# Altium schematic sheet Micro.SchDoc
size A4
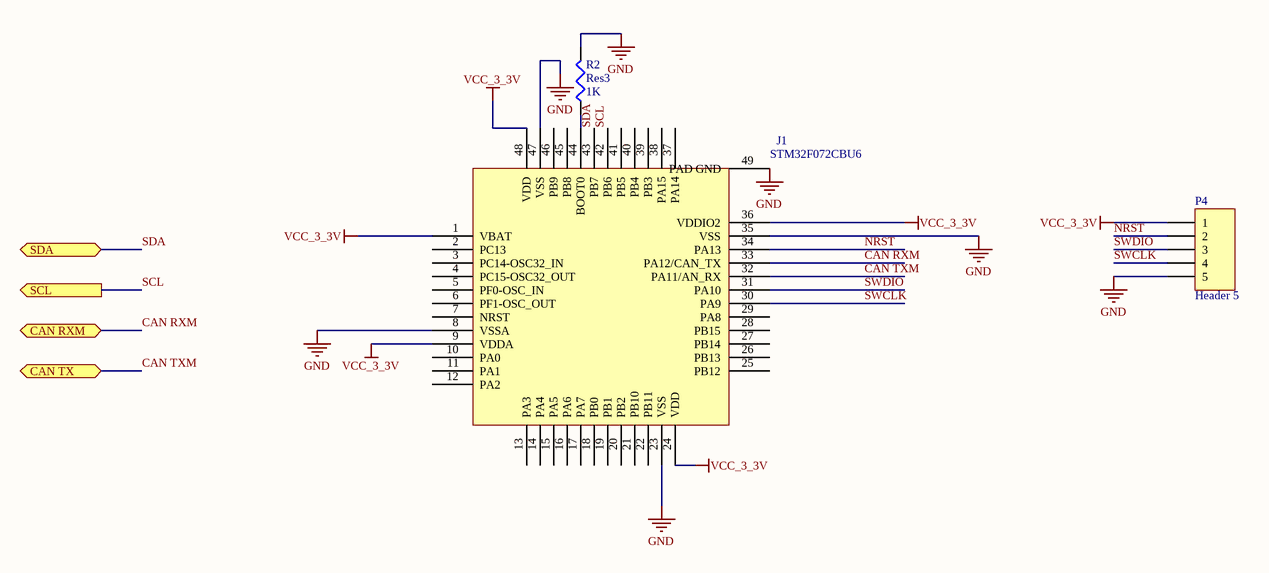
[diagram p0: Micro.SchDoc]

## Parts
J1  STM32F072CBU6  [STM32F072CBU6 - duplicate]
P4  Header 5  [HDR1X5]
R2  Res3  value 1K  [R0805]

## Ports
CAN RXM (bidir), CAN TX (bidir), SCL (out), SDA (bidir)

## Nets
GND: J1.8(VSSA) J1.23(VSS) J1.35(VSS) J1.47(VSS) J1.49(PAD_GND) P4.5 R2.2
VCC_3_3V: J1.1(VBAT) J1.9(VDDA) J1.24(VDD) J1.36(VDDIO2) J1.48(VDD) P4.1
CAN RXM: J1.33(PA12/CAN_TX) ; port CAN RXM
CAN TXM: J1.32(PA11/AN_RX) ; port CAN TX
NRST: J1.34(PA13) P4.2
SCL: J1.42(PB6) ; port SCL
SDA: J1.43(PB7) ; port SDA
SWCLK: J1.30(PA9) P4.4
SWDIO: J1.31(PA10) P4.3
NetJ1_44: J1.44(BOOT0) R2.1

Not connected (* = marked no-connect by the designer): J1 2(PC13) 3(PC14-OSC32_IN) 4(PC15-OSC32_OUT) 5(PF0-OSC_IN) 6(PF1-OSC_OUT) 7(NRST) 10(PA0) 11(PA1) 12(PA2) 13(PA3) 14(PA4) 15(PA5) 16(PA6) 17(PA7) 18(PB0) 19(PB1) 20(PB2) 21(PB10) 22(PB11) 25(PB12) 26(PB13) 27(PB14) 28(PB15) 29(PA8) 37(PA14) 38(PA15) 39(PB3) 40(PB4) 41(PB5) 45(PB8) 46(PB9)

## Library data of the parts
J1 = STM32F072CBU6: MICROCONTROLLER
P4 = Header 5: Header, 5-Pin; LatestRevisionDate: 17-Jul-2002; LatestRevisionNote: Re-released for DXP Platform.; Publisher: Altium Limited
R2 = Res3: Resistor; Published: 8-Jun-2000; LatestRevisionDate: 29-May-2009; LatestRevisionNote: IPC-7351 Footprint Added.; PackageReference: J1-0603; Publisher: Altium Limited; PackageDescription: Chip Resistor